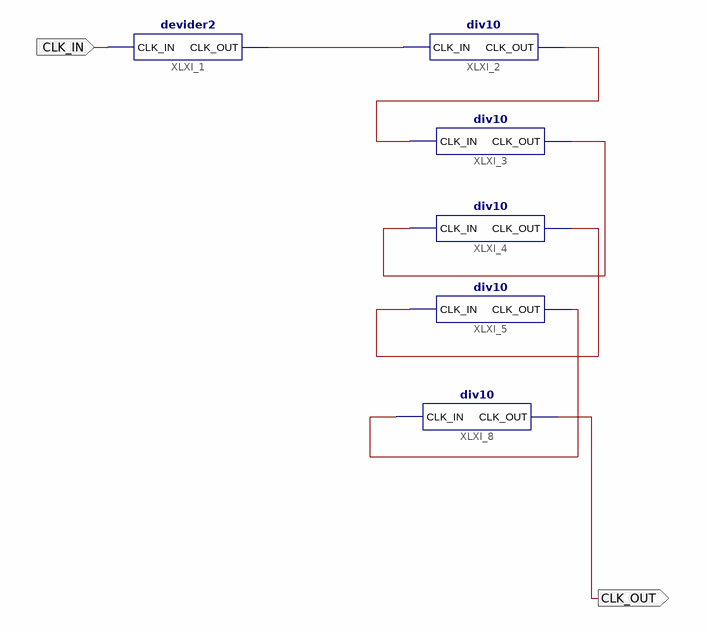
[diagram p0: schematic sheet 1]
// Xilinx ISE schematic CLK_DIV.sch (spartan6) as structural Verilog: 6 symbols, 2 ports
module CLK_DIV (
  input  CLK_IN,
  output CLK_OUT
);

  wire XLXN_1, XLXN_2, XLXN_3, XLXN_4, XLXN_5;

  devider2 XLXI_1 (.CLK_IN(CLK_IN), .CLK_OUT(XLXN_1));
  div10 XLXI_2 (.CLK_IN(XLXN_1), .CLK_OUT(XLXN_2));
  div10 XLXI_3 (.CLK_IN(XLXN_2), .CLK_OUT(XLXN_3));
  div10 XLXI_4 (.CLK_IN(XLXN_3), .CLK_OUT(XLXN_4));
  div10 XLXI_5 (.CLK_IN(XLXN_4), .CLK_OUT(XLXN_5));
  div10 XLXI_8 (.CLK_IN(XLXN_5), .CLK_OUT(CLK_OUT));
endmodule
